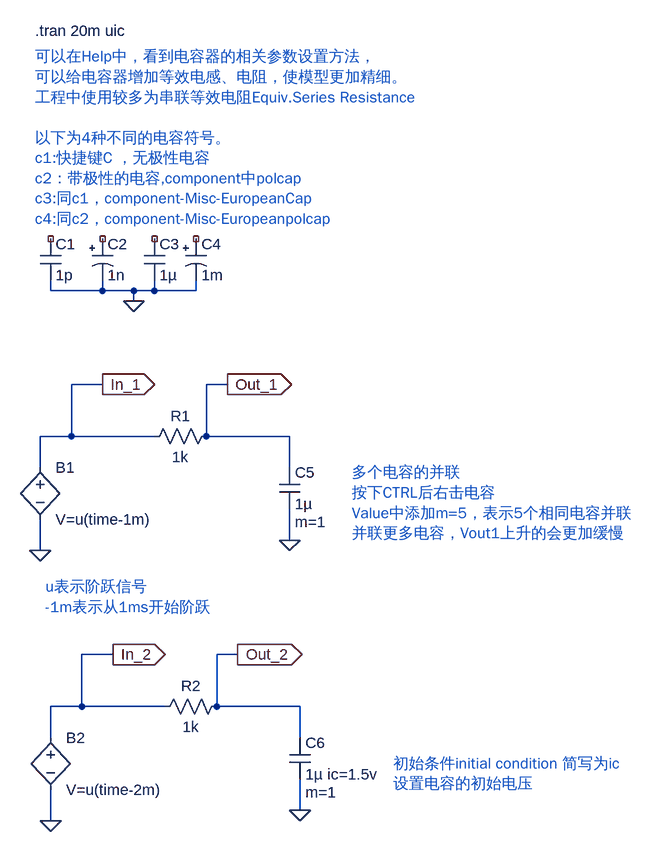
[diagram p0: schematic 11.电容.asc]
11.电容.asc, the LTspice schematic file:
Version 4
SHEET 1 988 1316
WIRE 48 400 48 384
WIRE 128 400 128 384
WIRE 128 400 48 400
WIRE 176 400 128 400
WIRE 208 400 208 384
WIRE 208 400 176 400
WIRE 272 400 272 384
WIRE 272 400 208 400
WIRE 176 416 176 400
WIRE 128 544 80 544
WIRE 320 544 288 544
WIRE 80 624 80 544
WIRE 80 624 32 624
WIRE 208 624 80 624
WIRE 288 624 288 544
WIRE 416 624 288 624
WIRE 32 672 32 624
WIRE 416 672 416 624
WIRE 416 784 416 736
WIRE 32 800 32 752
WIRE 144 960 96 960
WIRE 336 960 304 960
WIRE 96 1040 96 960
WIRE 96 1040 48 1040
WIRE 224 1040 96 1040
WIRE 304 1040 304 960
WIRE 432 1040 304 1040
WIRE 48 1088 48 1040
WIRE 432 1088 432 1040
WIRE 432 1200 432 1152
WIRE 48 1216 48 1168
FLAG 176 416 0
FLAG 32 800 0
FLAG 416 784 0
FLAG 128 544 In_1
IOPIN 128 544 Out
FLAG 320 544 Out_1
IOPIN 320 544 Out
FLAG 48 1216 0
FLAG 432 1200 0
FLAG 144 960 In_2
IOPIN 144 960 Out
FLAG 336 960 Out_2
IOPIN 336 960 Out
SYMBOL cap 32 320 R0
SYMATTR InstName C1
SYMATTR Value 1p
SYMBOL polcap 112 320 R0
SYMATTR InstName C2
SYMATTR Value 1n
SYMBOL Misc\\EuropeanCap 192 320 R0
SYMATTR InstName C3
SYMATTR Value 1µ
SYMBOL Misc\\EuropeanPolcap 256 320 R0
SYMATTR InstName C4
SYMATTR Value 1m
SYMBOL bv 32 656 R0
SYMATTR InstName B1
SYMATTR Value V=u(time-1m)
SYMBOL res 304 608 R90
WINDOW 0 0 56 VBottom 2
WINDOW 3 32 56 VTop 2
SYMATTR InstName R1
SYMATTR Value 1k
SYMBOL cap 400 672 R0
WINDOW 123 24 84 Left 2
SYMATTR Value2 m=1
SYMATTR InstName C5
SYMATTR Value 1µ
SYMBOL bv 48 1072 R0
SYMATTR InstName B2
SYMATTR Value V=u(time-2m)
SYMBOL res 320 1024 R90
WINDOW 0 0 56 VBottom 2
WINDOW 3 32 56 VTop 2
SYMATTR InstName R2
SYMATTR Value 1k
SYMBOL cap 416 1088 R0
WINDOW 123 24 84 Left 2
SYMATTR Value2 m=1
SYMATTR InstName C6
SYMATTR Value 1µ ic=1.5v
TEXT 24 40 Left 2 ;可以在Help中，看到电容器的相关参数设置方法，\n可以给电容器增加等效电感、电阻，使模型更加精细。\n工程中使用较多为串联等效电阻Equiv.Series Resistance\n \n以下为4种不同的电容符号。\nc1:快捷键C ，无极性电容\nc2：带极性的电容,component中polcap\nc3:同c1，component-Misc-EuropeanCap\nc4:同c2，component-Misc-Europeanpolcap
TEXT 512 680 Left 2 ;多个电容的并联\n按下CTRL后右击电容\nValue中添加m=5，表示5个相同电容并联\n并联更多电容，Vout1上升的会更加缓慢
TEXT 24 0 Left 2 !.tran 20m uic
TEXT 40 856 Left 2 ;u表示阶跃信号\n-1m表示从1ms开始阶跃
TEXT 576 1128 Left 2 ;初始条件initial condition 简写为ic\n设置电容的初始电压

The netlist it stands for:
* 11.电容.asc
C1 NC_01 0 1p
C2 NC_02 0 1n
C3 NC_03 0 1µ
C4 NC_04 0 1m
B1 In_1 0 V=u(time-1m)
R1 Out_1 In_1 1k
C5 Out_1 0 1µ m=1
B2 In_2 0 V=u(time-2m)
R2 Out_2 In_2 1k
C6 Out_2 0 1µ ic=1.5v m=1
* 可以在Help中，看到电容器的相关参数设置方法，
* 可以给电容器增加等效电感、电阻，使模型更加精细。
* 工程中使用较多为串联等效电阻Equiv.Series Resistance
* 以下为4种不同的电容符号。
* c1:快捷键C ，无极性电容
* c2：带极性的电容,component中polcap
* c3:同c1，component-Misc-EuropeanCap
* c4:同c2，component-Misc-Europeanpolcap
* 多个电容的并联
* 按下CTRL后右击电容
* Value中添加m=5，表示5个相同电容并联
* 并联更多电容，Vout1上升的会更加缓慢
.tran 20m uic
* u表示阶跃信号
* -1m表示从1ms开始阶跃
* 初始条件initial condition 简写为ic
* 设置电容的初始电压
.backanno
.end